# Altium schematic sheet 2_LVDS.schdoc
size 307 x 218 mm; Symbol: A4空白; Device: A4空白; @Project Name: 34567890; @Page Count: 7; @Update Date: 2025-05-12; @Create Date: 2025-03-11; @Schematic Name: Schematic1; @Page No: 2; @Page Name: LVDS; @Create Time: 07:05:34; @Board Name: PCB; @Update Time: 12:26:44; Title Block Position: 3; Width: 1170; Height: 825; Region Start: 1; X Region Count: 6; Y Region Count: 4; Blade Width: 10; SheetNumber: 2; SheetTotal: 7
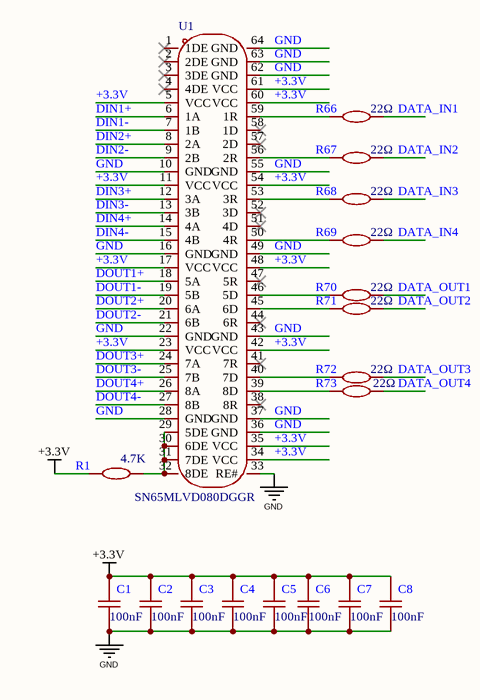
[diagram p0: 2_LVDS.schdoc]

## Parts
C1  100nF  [C0603]
C2  100nF  [C0603]
C3  100nF  [C0603]
C4  100nF  [C0603]
C5  100nF  [C0603]
C6  100nF  [C0603]
C7  100nF  [C0603]
C8  100nF  [C0603]
R1  4.7K  [R0603]
R66  22Ω  [R0603]
R67  22Ω  [R0603]
R68  22Ω  [R0603]
R69  22Ω  [R0603]
R70  22Ω  [R0603]
R71  22Ω  [R0603]
R72  22Ω  [R0603]
R73  22Ω  [R0603]
U1  SN65MLVD080DGGR  [TSSOP-64_L17.0-W6.1-P0.50-LS8.1-BL]

## Nets
+3.3V: C1.2 C2.2 C3.2 C4.2 C5.2 C6.2 C7.2 C8.2 R1.1 U1.5(VCC) U1.11(VCC) U1.17(VCC) U1.23(VCC) U1.34(VCC) U1.35(VCC) U1.42(VCC) U1.48(VCC) U1.54(VCC) U1.60(VCC) U1.61(VCC)
GND: C1.1 C2.1 C3.1 C4.1 C5.1 C6.1 C7.1 C8.1 U1.10(GND) U1.16(GND) U1.22(GND) U1.28(GND) U1.33(RE#) U1.36(GND) U1.37(GND) U1.43(GND) U1.49(GND) U1.55(GND) U1.62(GND) U1.63(GND) U1.64(GND)
DATA_IN1: R66.2
DATA_IN2: R67.2
DATA_IN3: R68.2
DATA_IN4: R69.2
DATA_OUT1: R70.2
DATA_OUT2: R71.2
DATA_OUT3: R72.2
DATA_OUT4: R73.2
DIN1+: U1.6(1A)
DIN1-: U1.7(1B)
DIN2+: U1.8(2A)
DIN2-: U1.9(2B)
DIN3+: U1.12(3A)
DIN3-: U1.13(3B)
DIN4+: U1.14(4A)
DIN4-: U1.15(4B)
DOUT1+: U1.18(5A)
DOUT1-: U1.19(5B)
DOUT2+: U1.20(6A)
DOUT2-: U1.21(6B)
DOUT3+: U1.24(7A)
DOUT3-: U1.25(7B)
DOUT4+: U1.26(8A)
DOUT4-: U1.27(8B)
NetR1_2: R1.2 U1.29(5DE) U1.30(6DE) U1.31(7DE) U1.32(8DE)
NetR66_1: R66.1 U1.59(1R)
NetR67_1: R67.1 U1.56(2R)
NetR68_1: R68.1 U1.53(3R)
NetR69_1: R69.1 U1.50(4R)
NetR70_1: R70.1 U1.46(5D)
NetR71_1: R71.1 U1.45(6D)
NetR72_1: R72.1 U1.40(7D)
NetR73_1: R73.1 U1.39(8D)

Not connected (* = marked no-connect by the designer): U1 1(1DE)* 2(2DE)* 3(3DE)* 4(4DE)* 38(8R)* 41(7R)* 44(6R)* 47(5R)* 51(4D)* 52(3D)* 57(2D)* 58(1D)*

## Notes on the sheet
- 1
- 2
- 3
- 4
- 5
- 6
- A
- B
- C
- D

## Library data of the parts
C1-C8 = CAP_0603: Device: CAP_0603
R1 R66-R73 = Res_0603: Device: Res_0603
U1 = SN65MLVD080DGGR: Device: SN65MLVD080DGGR